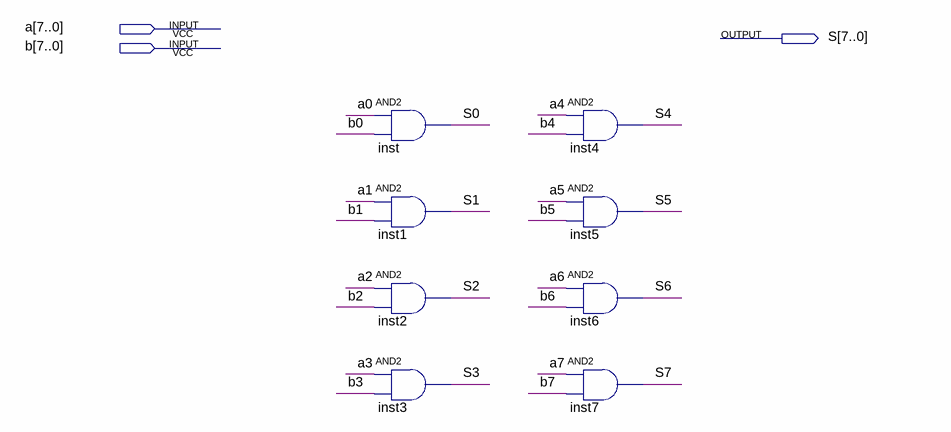
[diagram p0: schematic sheet]
// Quartus schematic and_8bits.bdf as structural Verilog: 8 symbols, 3 pins
module and_8bits (
  input  [7:0] a,
  input  [7:0] b,
  output [7:0] S
);

  and inst (S[0], a[0], b[0]);
  and inst1 (S[1], a[1], b[1]);
  and inst2 (S[2], a[2], b[2]);
  and inst3 (S[3], a[3], b[3]);
  and inst4 (S[4], a[4], b[4]);
  and inst5 (S[5], a[5], b[5]);
  and inst6 (S[6], a[6], b[6]);
  and inst7 (S[7], a[7], b[7]);
endmodule
